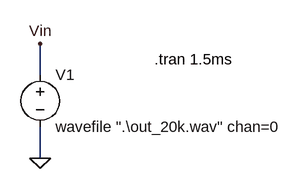
[diagram p0: schematic 001.asc]
001.asc, the LTspice schematic file:
Version 4
SHEET 1 1648 680
WIRE 80 128 80 80
WIRE 80 256 80 208
FLAG 80 256 0
FLAG 80 80 Vin
SYMBOL voltage 80 112 R0
SYMATTR InstName V1
SYMATTR Value wavefile ".\out_20k.wav" chan=0
TEXT 256 104 Left 2 !.tran 1.5ms

The netlist it stands for:
* 001.asc
V1 Vin 0 wavefile ".\out_20k.wav" chan=0
.tran 1.5ms
.backanno
.end